# EAGLE design stm32f4 (EAGLE 6.4)
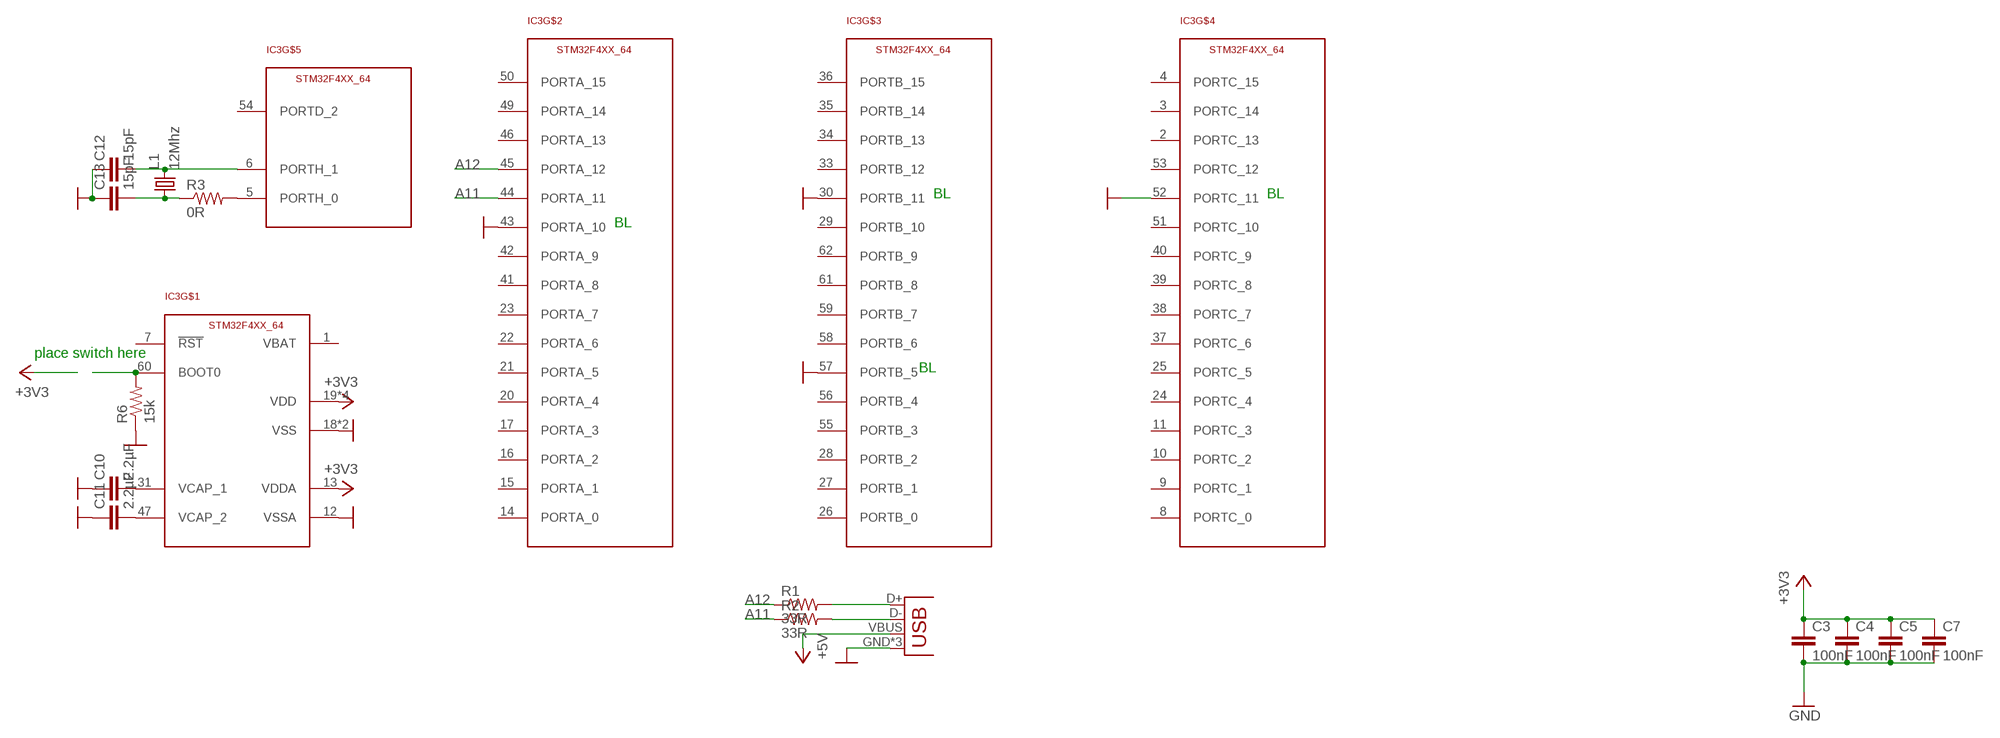
[diagram p0: schematic, sheet 1]

## Parts
C3  100nF  CAP0402-CAP  [0402-CAP]
C4  100nF  CAP0402-CAP  [0402-CAP]
C5  100nF  CAP0402-CAP  [0402-CAP]
C7  100nF  CAP0402-CAP  [0402-CAP]
C10  2.2µF  CAP0805  [0805]
C11  2.2µF  CAP0805  [0805]
C12  15pF  CAP0402-CAP  [0402-CAP]
C13  15pF  CAP0402-CAP  [0402-CAP]
IC3  STM32F4XX_64  [TQFP64]
JP1  USB-MICROB  [USB-MICROB]
L1  12Mhz  X22-OSCILLATOR  [X22]
R1  33R  RESISTOR0402-RES  [0402-RES]
R2  33R  RESISTOR0402-RES  [0402-RES]
R3  0R  RESISTOR0402-RES  [0402-RES]
R6  15k  RESISTOR0402-RES  [0402-RES]

## Nets
+3V3: C3.1 C4.1 C5.1 C7.1 IC3.13(VDDA) IC3.19(VDD) IC3.32(VDD) IC3.48(VDD) IC3.64(VDD)
+5V: JP1.VBUS
A11: IC3.44(PORTA_11) R2.1
A12: IC3.45(PORTA_12) R1.1
GND: C3.2 C4.2 C5.2 C7.2 C10.1 C11.1 C12.1 C13.1 IC3.12(VSSA) IC3.18(VSS) IC3.30(PORTB_11) IC3.43(PORTA_10) IC3.52(PORTC_11) IC3.57(PORTB_5) IC3.63(VSS) JP1.GND JP1.MT1(GND) JP1.MT2(GND) R6.1
N$1: JP1.D- R2.2
N$2: JP1.D+ R1.2
N$3: C10.2 IC3.31(VCAP_1)
N$4: C11.2 IC3.47(VCAP_2)
N$5: IC3.5(PORTH_0) R3.2
N$6: C13.2 L1.1 R3.1
N$7: C12.2 IC3.6(PORTH_1) L1.3
SW1: IC3.60(BOOT0) R6.2
Unconnected: IC3.1(VBAT) IC3.2(PORTC_13) IC3.3(PORTC_14) IC3.4(PORTC_15) IC3.7(!RST) IC3.8(PORTC_0) IC3.9(PORTC_1) IC3.10(PORTC_2) IC3.11(PORTC_3) IC3.14(PORTA_0) IC3.15(PORTA_1) IC3.16(PORTA_2) IC3.17(PORTA_3) IC3.20(PORTA_4) IC3.21(PORTA_5) IC3.22(PORTA_6) IC3.23(PORTA_7) IC3.24(PORTC_4) IC3.25(PORTC_5) IC3.26(PORTB_0) IC3.27(PORTB_1) IC3.28(PORTB_2) IC3.29(PORTB_10) IC3.33(PORTB_12) IC3.34(PORTB_13) IC3.35(PORTB_14) IC3.36(PORTB_15) IC3.37(PORTC_6) IC3.38(PORTC_7) IC3.39(PORTC_8) IC3.40(PORTC_9) IC3.41(PORTA_8) IC3.42(PORTA_9) IC3.46(PORTA_13) IC3.49(PORTA_14) IC3.50(PORTA_15) IC3.51(PORTC_10) IC3.53(PORTC_12) IC3.54(PORTD_2) IC3.55(PORTB_3) IC3.56(PORTB_4) IC3.58(PORTB_6) IC3.59(PORTB_7) IC3.61(PORTB_8) IC3.62(PORTB_9)

## Notes on the sheet
- BL | BL
- BL
- place switch here
- BL

## Library data of the parts
C3-C5 C7 C10-C13 = SparkFun-Capacitors:CAP: Capacitor Standard 0603 ceramic capacitor, and 0.1" leaded capacitor.
IC3 = stm32:STM32F4XX_64
JP1 = SparkFun-Connectors:USB: USB Connectors USB-B-PTH is fully proven SKU : PRT-00139/CONN-08278 USB-miniB is fully proven SKU : PRT-00587 USB-A-PCB is untested. USB-A-H is throughly reviewed, but untested. Spark Fun Electronics SKU : PRT-00437 USB-B-SMT is throughly reviewed, but untested. Needs silkscreen touching up. USB-A-S has not been used/tested USB-MB-H has not been used/tested USB-MICROB has been used. CONN-09505; PROD_ID: CONN-09505
L1 = seb:X22-OSCILLATOR
R1-R3 = SparkFun-Resistors:RESISTOR: Resistor
R6 = SparkFun:RESISTOR: Resistor

## Board
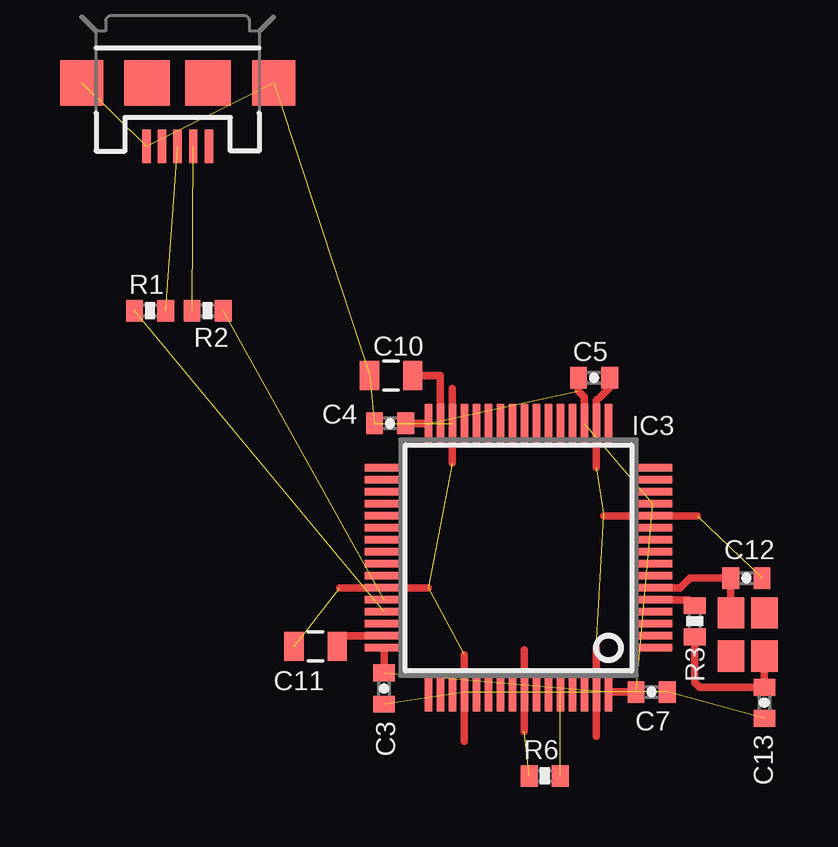
[diagram p1: board, top side]

No outline drawn. Coordinates in mm, seen from the top.
Copper layers (1*16): Top 0.035mm / dielectric 1.5mm / Bottom 0.035mm
Design rules "default": minimum track width 10mil, minimum drill 0.4mm, track to track 8mil, track to pad 8mil, pad to pad 8mil, via to via 8mil, smd to smd 8mil, copper to edge 30mil, drill to drill 8mil, minimum pad ring 10mil, minimum via ring 8mil, stop-mask expansion 4mil, vias tented up to drill 1.5mm, thermal gap 10mil

### Footprints (pad centres in the part's own frame; a part is rotated, then mirrored left to right if it is on the bottom)
0402-CAP = smd 0.7 x 0.9: 1 -0.65,0; 2 0.65,0
0805 = smd 0.8 x 1.2: 1 -0.9,0; 2 0.9,0
TQFP64 = smd 0.3 x 1.6: 1 -3.75,-5.6; 2 -3.25,-5.6; 3 -2.75,-5.6; 4 -2.25,-5.6; 5 -1.75,-5.6; 6 -1.25,-5.6; 7 -0.75,-5.6; 8 -0.25,-5.6; 9 0.25,-5.6; 10 0.75,-5.6; 11 1.25,-5.6; 12 1.75,-5.6; 13 2.25,-5.6; 14 2.75,-5.6; 15 3.25,-5.6; 16 3.75,-5.6; 33 3.75,5.6; 34 3.25,5.6; 35 2.75,5.6; 36 2.25,5.6; 37 1.75,5.6; 38 1.25,5.6; 39 0.75,5.6; 40 0.25,5.6; 41 -0.25,5.6; 42 -0.75,5.6; 43 -1.25,5.6; 44 -1.75,5.6; 45 -2.25,5.6; 46 -2.75,5.6; 47 -3.25,5.6; 48 -3.75,5.6 | smd 1.6 x 0.3: 17 5.6,-3.75; 18 5.6,-3.25; 19 5.6,-2.75; 20 5.6,-2.25; 21 5.6,-1.75; 22 5.6,-1.25; 23 5.6,-0.75; 24 5.6,-0.25; 25 5.6,0.25; 26 5.6,0.75; 27 5.6,1.25; 28 5.6,1.75; 29 5.6,2.25; 30 5.6,2.75; 31 5.6,3.25; 32 5.6,3.75; 49 -5.6,3.75; 50 -5.6,3.25; 51 -5.6,2.75; 52 -5.6,2.25; 53 -5.6,1.75; 54 -5.6,1.25; 55 -5.6,0.75; 56 -5.6,0.25; 57 -5.6,-0.25; 58 -5.6,-0.75; 59 -5.6,-1.25; 60 -5.6,-1.75; 61 -5.6,-2.25; 62 -5.6,-2.75; 63 -5.6,-3.25; 64 -5.6,-3.75
USB-MICROB = smd 0.35 x 1.4: D+ 0,2.65; D- -0.65,2.65; GND 1.3,2.65; ID 0.65,2.65; VBUS -1.3,2.65 | smd 1.8 x 1.9: MT1 -4,0; MT2 4,0 | smd 1.9 x 1.9: P$1 -1.27,0; P$2 1.27,0
X22 = smd 1.3 x 1.1: 1 0.9,0.7; 2 -0.9,0.7; 3 -0.9,-0.7; 4 0.9,-0.7
0402-RES = smd 0.7 x 0.9: 1 -0.65,0; 2 0.65,0

### Placement (x,y rotation side)
C3  26.1,5.05 270 top
C4  26.35,16.1 180 top
C5  34.85,18 0 top
C7  37.25,4.9 0 top
C10  26.4,18.1 0 top
C11  23.25,6.8 0 top
C12  41.2,9.65 180 top
C13  41.95,4.45 90 top
IC3  31.7,10.5 90 top
JP1  17.5,30.3 180 top
L1  41.25,7.3 270 top
R1  16.35,20.8 0 top
R2  18.75,20.8 180 top
R3  39.05,7.85 90 top
R6  32.8,1.4 0 top

### Tracks (layer width: path | path; a pad name or v marks a point on that pad's centre or on a via)
+3V3  (4 unrouted)
  Top 0.305: IC3.19 34.45,17.2 34.3,17.35 34.2,17.45 | 34.2,17.45 C5.1 34.2,17.45 | IC3.48 C3.1 | C4.1 IC3.32 | C7.1 IC3.64
A11  (1 unrouted)
A12  (1 unrouted)
GND  (17 unrouted)
  Top 0.305: C5.2 35.5,17.6 35.15,17.25 34.95,17.05 IC3.18 34.95,14.25 | 29.45,6.45 IC3.52 29.45,2.85 | 31.95,3.25 IC3.57 31.95,6.65 | 34.95,3.05 IC3.63 34.95,6.75 | 24.25,9.25 IC3.43 27.95,9.25 | 39.15,12.25 IC3.12 35.25,12.25 | 28.95,14.45 IC3.30 28.95,17.55
N$1  (1 unrouted)
N$2  (1 unrouted)
N$3
  Top 0.305: IC3.31 28.45,18.1 C10.2
N$4
  Top 0.305: IC3.47 24.15,7.25 C11.2
N$5
  Top 0.305: IC3.5 38.8,8.75 R3.2
N$6
  Top 0.305: R3.1 39.05,5.3 39.25,5.1 C13.2 L1.1
N$7
  Top 0.305: L1.3 C12.2 38.85,9.65 38.8,9.6 38.45,9.25 IC3.6
SW1  (1 unrouted)